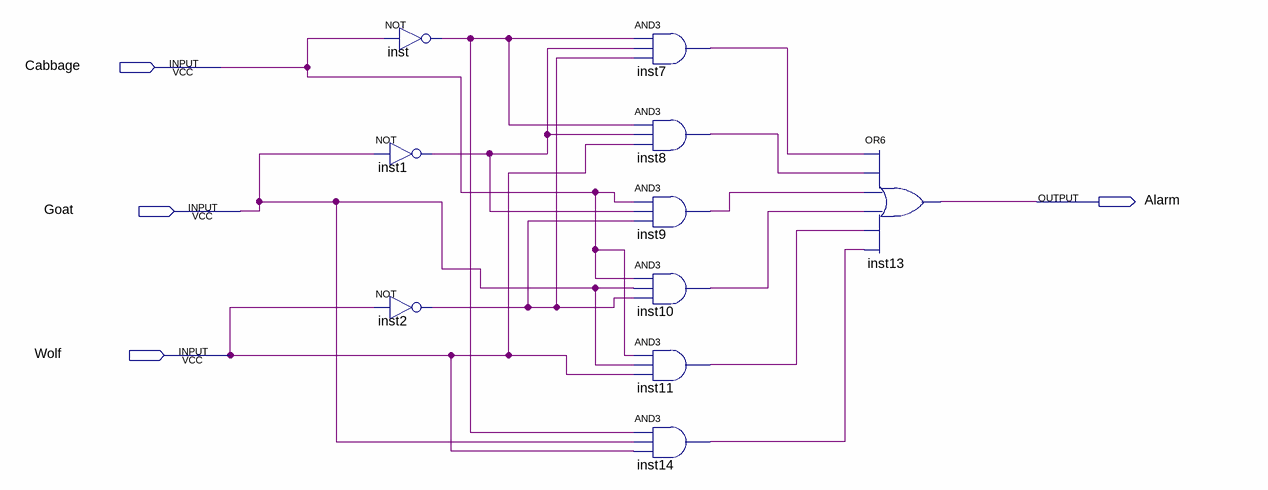
[diagram p0: schematic sheet]
// Quartus schematic lab2step2.bdf as structural Verilog: 10 symbols, 4 pins
module lab2step2 (
  input  Cabbage,
  input  Goat,
  input  Wolf,
  output Alarm
);

  wire inst1_out, inst2_out, inst7_out, inst8_out, inst9_out, inst10_out, inst11_out, inst14_out, inst_out;

  not inst (inst_out, Cabbage);
  not inst1 (inst1_out, Goat);
  not inst2 (inst2_out, Wolf);
  and inst7 (inst7_out, inst_out, inst1_out, inst2_out);
  and inst8 (inst8_out, inst_out, inst1_out, Wolf);
  and inst9 (inst9_out, Cabbage, inst1_out, inst2_out);
  and inst10 (inst10_out, Cabbage, Goat, inst2_out);
  and inst11 (inst11_out, Cabbage, Goat, Wolf);
  and inst14 (inst14_out, inst_out, Goat, Wolf);
  or inst13 (Alarm, inst7_out, inst8_out, inst9_out, inst10_out, inst11_out, inst14_out);
endmodule
